# EAGLE schematic emonBuck v0.3 (EAGLE 9.3.1)
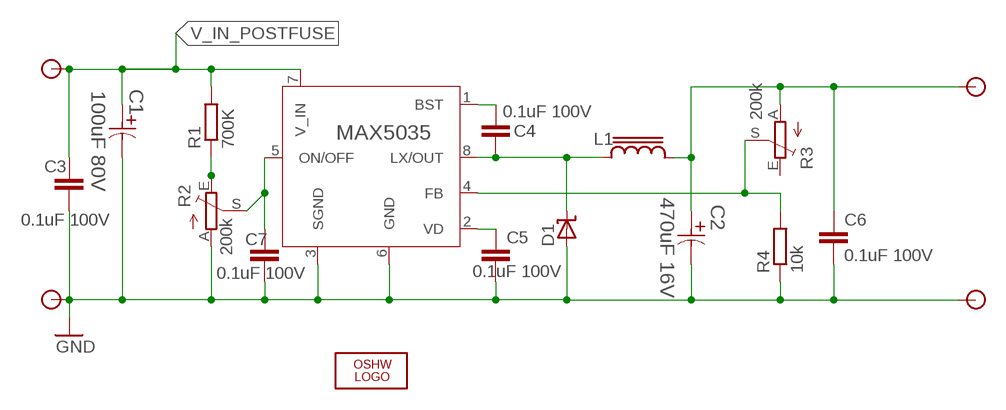
[diagram p0: schematic, sheet 1]

## Parts
C1  100uF 80V  EEV-FK1K101Q-CASE-H13  [CAPAE1350X1400N]
C2  470uF 16V  EEE-FK1C471P-CASE-F  [CAPAE830X1050N]
C3  0.1uF 100V  C-EUC0603  [C0603]
C4  0.1uF 100V  C-EUC0603  [C0603]
C5  0.1uF 100V  C-EUC0603  [C0603]
C6  0.1uF 100V  C-EUC0603  [C0603]
C7  0.1uF 100V  C-EUC0603  [C0603]
D1  MBRS1100T3G  [SMB_1]
L1  SRR1208  [SSR1208]
LOGO1  OSHW_LOGO_6MILX0200-NT  [OSHW_6X200_NOTEXT]
MAX5035  MAX5035  [21-0111D_SBE-14]
R1  700K  R-EU_R0603  [R0603]
R2  200k  TRIM_EU-B64W  [B64W]
R3  200k  TRIM_EU-B64W  [B64W]
R4  10k  R-EU_R0603  [R0603]
U$1  TP0.8MM  [TP0.8]
U$2  TP0.8MM  [TP0.8]
U$3  TP0.8MM  [TP0.8]
U$4  TP0.8MM  [TP0.8]

## Nets
BST [thin_power]: C4.1 MAX5035.1(BST)
GND: C1.2 C2.2 C3.2 C5.2 C6.2 C7.2 D1.A MAX5035.3(SGND) MAX5035.6(GND) R2.A R4.1 U$2.P$1 U$4.P$1
LX [thin_power]: C4.2 D1.C L1.1 MAX5035.8(LX/OUT)
N$1: MAX5035.4(FB) R3.S R4.2
N$2: C7.1 MAX5035.5(ON/OFF) R2.S
N$3 [thin_power]: R1.1 R2.E
PRE_6.5V [thin_power]: C2.1 C6.1 L1.2 R3.A U$3.P$1
V_IN_POSTFUSE [thin_power]: C1.1 C3.1 MAX5035.7(V_IN) R1.2 U$1.P$1
VD [thin_power]: C5.1 MAX5035.2(VD)
Unconnected: R3.E

## Library data of the parts
C1 = Panasonic-EEE-EEV-EEF-ECQ:EEV-: Aluminum Electrolytic Capacitors,Surface Mount Type; MPN: EEVFK1K101Q; OC_FARNELL: 9696113; OC_NEWARK: 96K9484; SUPPLIER: PANASONIC; TOLERANCE: ±20 %; VALUE: 100UF; VOLTAGERATING: 80V
C2 = Panasonic-EEEFK_EEEFP:EEE-: Aluminum Electrolytic Capacitors,Surface Mount Type; MPN: EEE-FK1C471P; OC_FARNELL: 9695710; OC_NEWARK: 96K9385; PACKAGE: CASE-F; SUPPLIER: PANASONIC; TOLERANCE: ±20 %; VALUE: 470UF; VOLTAGERATING: 16V
C3-C7 = rcl:C-EU: CAPACITOR, European symbol; SPICEPREFIX: C
D1 = diodes:MBRS1100T3G: MBRS1100T3G 100V 1A Freewheeling Diode; MPN: MBRS1100T3G
L1 = inductor-bourns:SRR1208: POWER INDUCTOR; MPN: SRR1208-151YL
LOGO1 = ohw-logo:OSHW_LOGO_6MIL; OC_FARNELL: unknown
MAX5035 = MAX5035:MAX5035: SWITCHING REGULATOR 5.0V 1.0A; MPN: MAX5035EASA+
R1 R4 = rcl@1:R-EU_: RESISTOR, European symbol
R2 R3 = pot:TRIM_EU-: POTENTIOMETER
U$1-U$4 = testpad_db:TP

## Net classes
0 default: clearance 0.203 mm
1 power: width 0.61 mm, clearance 0.61 mm
2 thin_power: width 0.406 mm, clearance 0.305 mm